# Altium schematic sheet etna-sch-mcu.SchDoc
size A4; SheetNumber: 3; SheetTotal: 6; PageSetup: Record=PageOptions|CenterHorizontal=True|CenterVertical=True|PrintScale=0.73|XCorrection=1.00|YCorrection=1.00|PrintKind=1|BorderSize=5000000|LeftOffset=0|BottomOffset=0|Orientation=2|PaperLength=1000|PaperWidth=1000|Scale=100|PaperSource=15|PrintQuality=1200|MediaType=1|DitherType=10|PaperKind=A4|PrintScaleMode=1
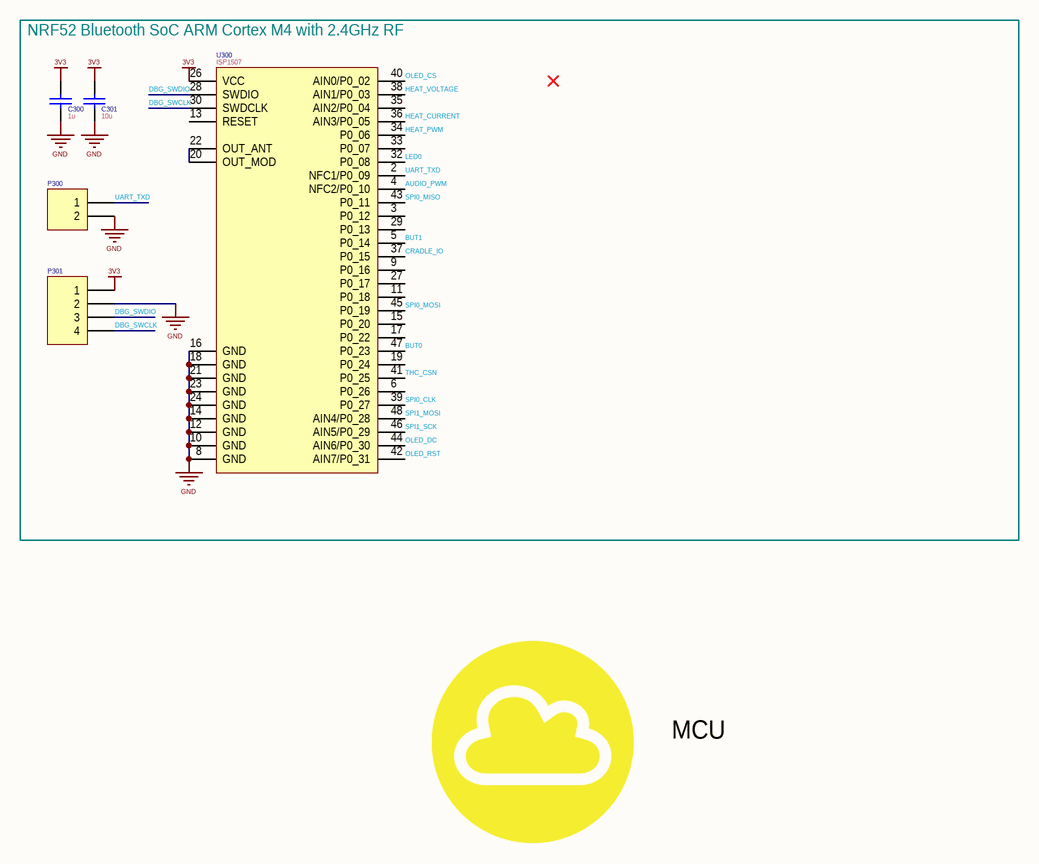
[diagram p0: etna-sch-mcu.SchDoc]

## Parts
C300  1u  [0402-capacitor]
C301  10u  [0603-capacitor]
P300  (no value)  [HDR1X2]
P301  (no value)  [HDR1X4]
U300  ISP1507  [ISP1507]

## Blocks framed on the sheet
NRF52 Bluetooth SoC ARM Cortex M4 with 2.4GHz RF: C300 C301 P300 P301 U300

## Nets
3V3: C300.2 C301.2 P301.1 U300.26(VCC)
GND: C300.1 C301.1 P300.2 P301.2 U300.8(GND) U300.10(GND) U300.12(GND) U300.14(GND) U300.16(GND) U300.18(GND) U300.21(GND) U300.23(GND) U300.24(GND)
AUDIO_PWM: U300.4(NFC2/P0_10)
BUT0: U300.47(P0_23)
BUT1: U300.5(P0_14)
CRADLE_IO: U300.37(P0_15)
DBG_SWCLK: P301.4 U300.30(SWDCLK)
DBG_SWDIO: P301.3 U300.28(SWDIO)
HEAT_CURRENT: U300.36(AIN3/P0_05)
HEAT_PWM: U300.34(P0_06)
HEAT_VOLTAGE: U300.38(AIN1/P0_03)
LED0: U300.32(P0_08)
OLED_CS: U300.40(AIN0/P0_02)
OLED_DC: U300.44(AIN6/P0_30)
OLED_RST: U300.42(AIN7/P0_31)
SPI0_CLK: U300.39(P0_27)
SPI0_MISO: U300.43(P0_11)
SPI0_MOSI: U300.45(P0_19)
SPI1_MOSI: U300.48(AIN4/P0_28)
SPI1_SCK: U300.46(AIN5/P0_29)
THC_CSN: U300.41(P0_25)
UART_TXD: P300.1 U300.2(NFC1/P0_09)
NetU300_20: U300.20(OUT_MOD) U300.22(OUT_ANT)

Not connected (* = marked no-connect by the designer): U300 1(NC) 3(P0_12) 6(P0_26) 7(NC) 9(P0_16) 11(P0_18) 13(RESET) 15(P0_20) 17(P0_22) 19(P0_24) 25(NC) 27(P0_17) 29(P0_13) 31(NC) 33(P0_07) 35(AIN2/P0_04) 49(NC) 50(NC) 51(NC) 52(NC) 53(NC) 54(NC) 55(NC) 56(NC) 57(NC) 58(NC) 59(NC) 60(NC) 61(NC) 62(NC)

## Notes on the sheet
- MCU

## Library data of the parts
C300 C301 = CAP: Capacitor
P300 = Header 2: Header, 2-Pin; LatestRevisionDate: 17-Jul-2002; LatestRevisionNote: Re-released for DXP Platform.; Publisher: Altium Limited
P301 = Header 4: Header, 4-Pin; LatestRevisionDate: 17-Jul-2002; LatestRevisionNote: Re-released for DXP Platform.; Publisher: Altium Limited
U300 = ISP1507: High Performance Bluetooth+ANT+NFC Low Energy Module with MCU and Antenna